# Altium schematic sheet Sheet1.SchDoc
size A4
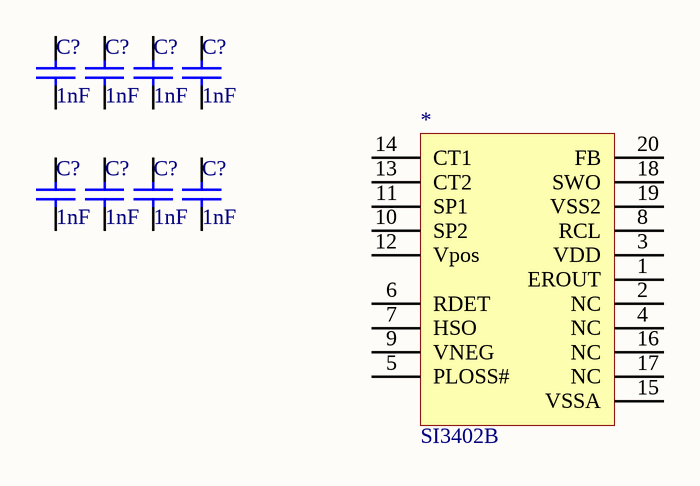
[diagram p0: Sheet1.SchDoc]

## Parts
(Parts that share a designator on the sheet are numbered #1, #2 ... from top to bottom, then left to right.)
*  SI3402B  [SI3402B]
C?#1  value 1nF  [0402_C]
C?#2  value 1nF  [0402_C]
C?#3  value 1nF  [0402_C]
C?#4  value 1nF  [0402_C]
C?#5  value 1nF  [0402_C]
C?#6  value 1nF  [0402_C]
C?#7  value 1nF  [0402_C]
C?#8  value 1nF  [0402_C]

## Nets

Not connected (* = marked no-connect by the designer): * 1(EROUT) 2(NC) 3(VDD) 4(NC) 5(PLOSS#) 6(RDET) 7(HSO) 8(RCL) 9(VNEG) 10(SP2) 11(SP1) 12(Vpos) 13(CT2) 14(CT1) 15(VSSA) 16(NC) 17(NC) 18(SWO) 19(VSS2) 20(FB); C?#1 1 2; C?#2 1 2; C?#3 1 2; C?#4 1 2; C?#5 1 2; C?#6 1 2; C?#7 1 2; C?#8 1 2

## Library data of the parts
* = SI3402B: PoE with DC-DC
C?#1-C?#8 = Cap: Published: 8-Jun-2000; LatestRevisionDate: 29-May-2009; LatestRevisionNote: IPC-7351 Footprint Added.; PackageReference: C1206; Publisher: Altium Limited; PackageDescription: Chip Capacitor